# Altium schematic sheet Top_Level.SchDoc: Top Level
size Letter; Date: Oct-10-2023; Author: Joe Thurston; DrawnBy: Joe Thurston; Engineer: Joe Thurston; SheetNumber: 1; SheetTotal: 13
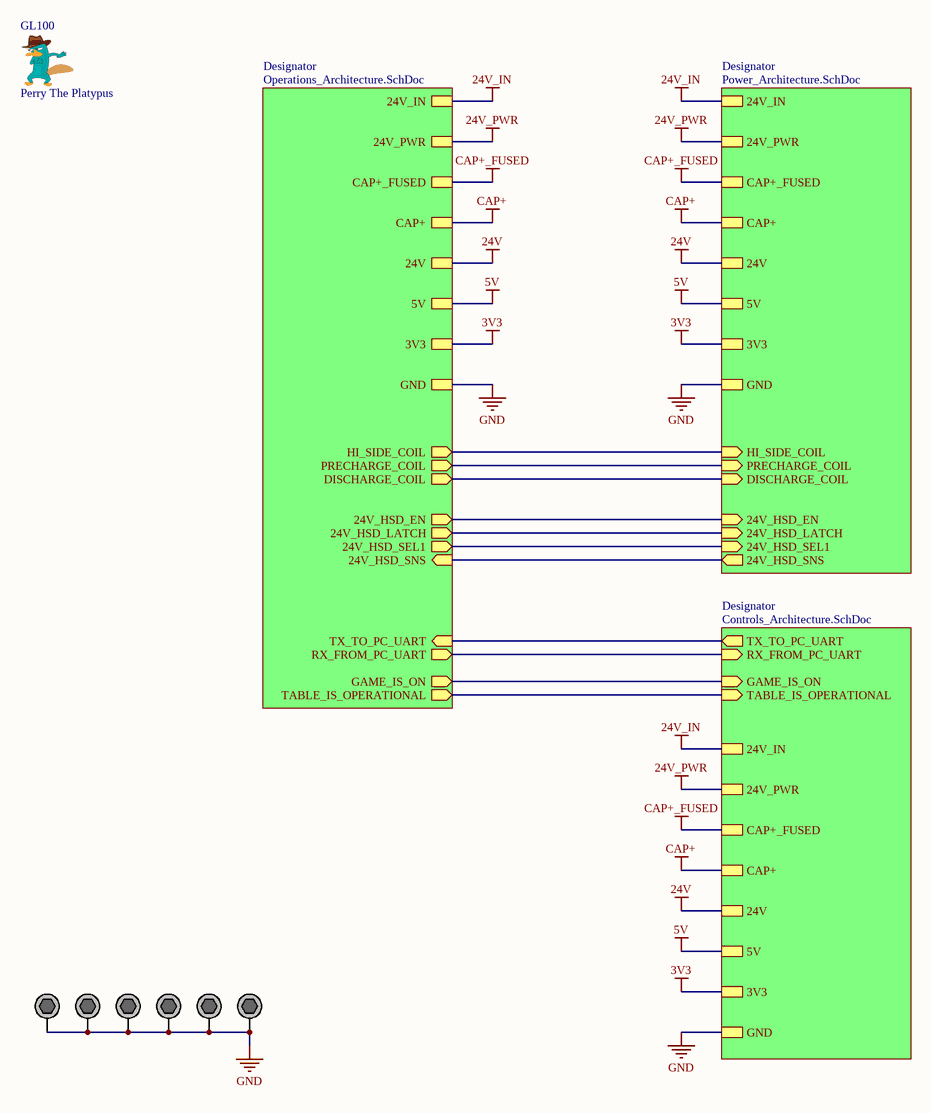
[diagram p0: Top_Level.SchDoc]

## Parts
GL100  Perry The Platypus  [Perry the Platypus]  (no BOM)
MH100  M3 Mounting Hole Plated  [M3 Screw Hole - Plated]  (value not drawn)  (no BOM)
MH101  M3 Mounting Hole Plated  [M3 Screw Hole - Plated]  (value not drawn)  (no BOM)
MH102  M3 Mounting Hole Plated  [M3 Screw Hole - Plated]  (value not drawn)  (no BOM)
MH103  M3 Mounting Hole Plated  [M3 Screw Hole - Plated]  (value not drawn)  (no BOM)
MH104  M3 Mounting Hole Plated  [M3 Screw Hole - Plated]  (value not drawn)  (no BOM)
MH105  M3 Mounting Hole Plated  [M3 Screw Hole - Plated]  (value not drawn)  (no BOM)

## Sub-sheets
Designator = Power_Architecture.SchDoc: HI_SIDE_COIL (in), PRECHARGE_COIL (in), DISCHARGE_COIL (in), 24V_IN, 5V, 3V3, GND, 24V_PWR, CAP+_FUSED, CAP+, 24V, 24V_HSD_SEL1 (in), 24V_HSD_SNS (out), 24V_HSD_LATCH (in), 24V_HSD_EN (in)
Designator = Operations_Architecture.SchDoc: HI_SIDE_COIL (out), PRECHARGE_COIL (out), DISCHARGE_COIL (out), 24V_IN, 5V, 3V3, GND, 24V_PWR, CAP+_FUSED, CAP+, 24V, GAME_IS_ON (out), TABLE_IS_OPERATIONAL (out), TX_TO_PC_UART (in), RX_FROM_PC_UART (out), 24V_HSD_EN (out), 24V_HSD_LATCH (out), 24V_HSD_SEL1 (out), 24V_HSD_SNS (in)
Designator = Controls_Architecture.SchDoc: GAME_IS_ON (in), TABLE_IS_OPERATIONAL (in), 24V_IN, 5V, 3V3, GND, 24V_PWR, CAP+_FUSED, CAP+, 24V, TX_TO_PC_UART (out), RX_FROM_PC_UART (in)

## Nets
3V3: sheet Designator/3V3, sheet Designator/3V3, sheet Designator/3V3
5V: sheet Designator/5V, sheet Designator/5V, sheet Designator/5V
24V: sheet Designator/24V, sheet Designator/24V, sheet Designator/24V
24V_IN: sheet Designator/24V_IN, sheet Designator/24V_IN, sheet Designator/24V_IN
24V_PWR: sheet Designator/24V_PWR, sheet Designator/24V_PWR, sheet Designator/24V_PWR
CAP+: sheet Designator/CAP+, sheet Designator/CAP+, sheet Designator/CAP+
CAP+_FUSED: sheet Designator/CAP+_FUSED, sheet Designator/CAP+_FUSED, sheet Designator/CAP+_FUSED
GND: MH100.1 MH101.1 MH102.1 MH103.1 MH104.1 MH105.1 ; sheet Designator/GND, sheet Designator/GND, sheet Designator/GND
(unnamed): sheet Designator/HI_SIDE_COIL, sheet Designator/HI_SIDE_COIL
(unnamed): sheet Designator/PRECHARGE_COIL, sheet Designator/PRECHARGE_COIL
(unnamed): sheet Designator/DISCHARGE_COIL, sheet Designator/DISCHARGE_COIL
(unnamed): sheet Designator/24V_HSD_SEL1, sheet Designator/24V_HSD_SEL1
(unnamed): sheet Designator/24V_HSD_SNS, sheet Designator/24V_HSD_SNS
(unnamed): sheet Designator/24V_HSD_LATCH, sheet Designator/24V_HSD_LATCH
(unnamed): sheet Designator/24V_HSD_EN, sheet Designator/24V_HSD_EN
(unnamed): sheet Designator/GAME_IS_ON, sheet Designator/GAME_IS_ON
(unnamed): sheet Designator/TABLE_IS_OPERATIONAL, sheet Designator/TABLE_IS_OPERATIONAL
(unnamed): sheet Designator/TX_TO_PC_UART, sheet Designator/TX_TO_PC_UART
(unnamed): sheet Designator/RX_FROM_PC_UART, sheet Designator/RX_FROM_PC_UART

## Library data of the parts
MH100-MH105 = CMP-019-000000-2: Source: UBC Formula Electric.SchLib; Design Item ID: M3 Mounting Hole Plated